# EasyEDA Pro project STM32F767_F429_H743底板原理图_PCB.eprj, board 底板
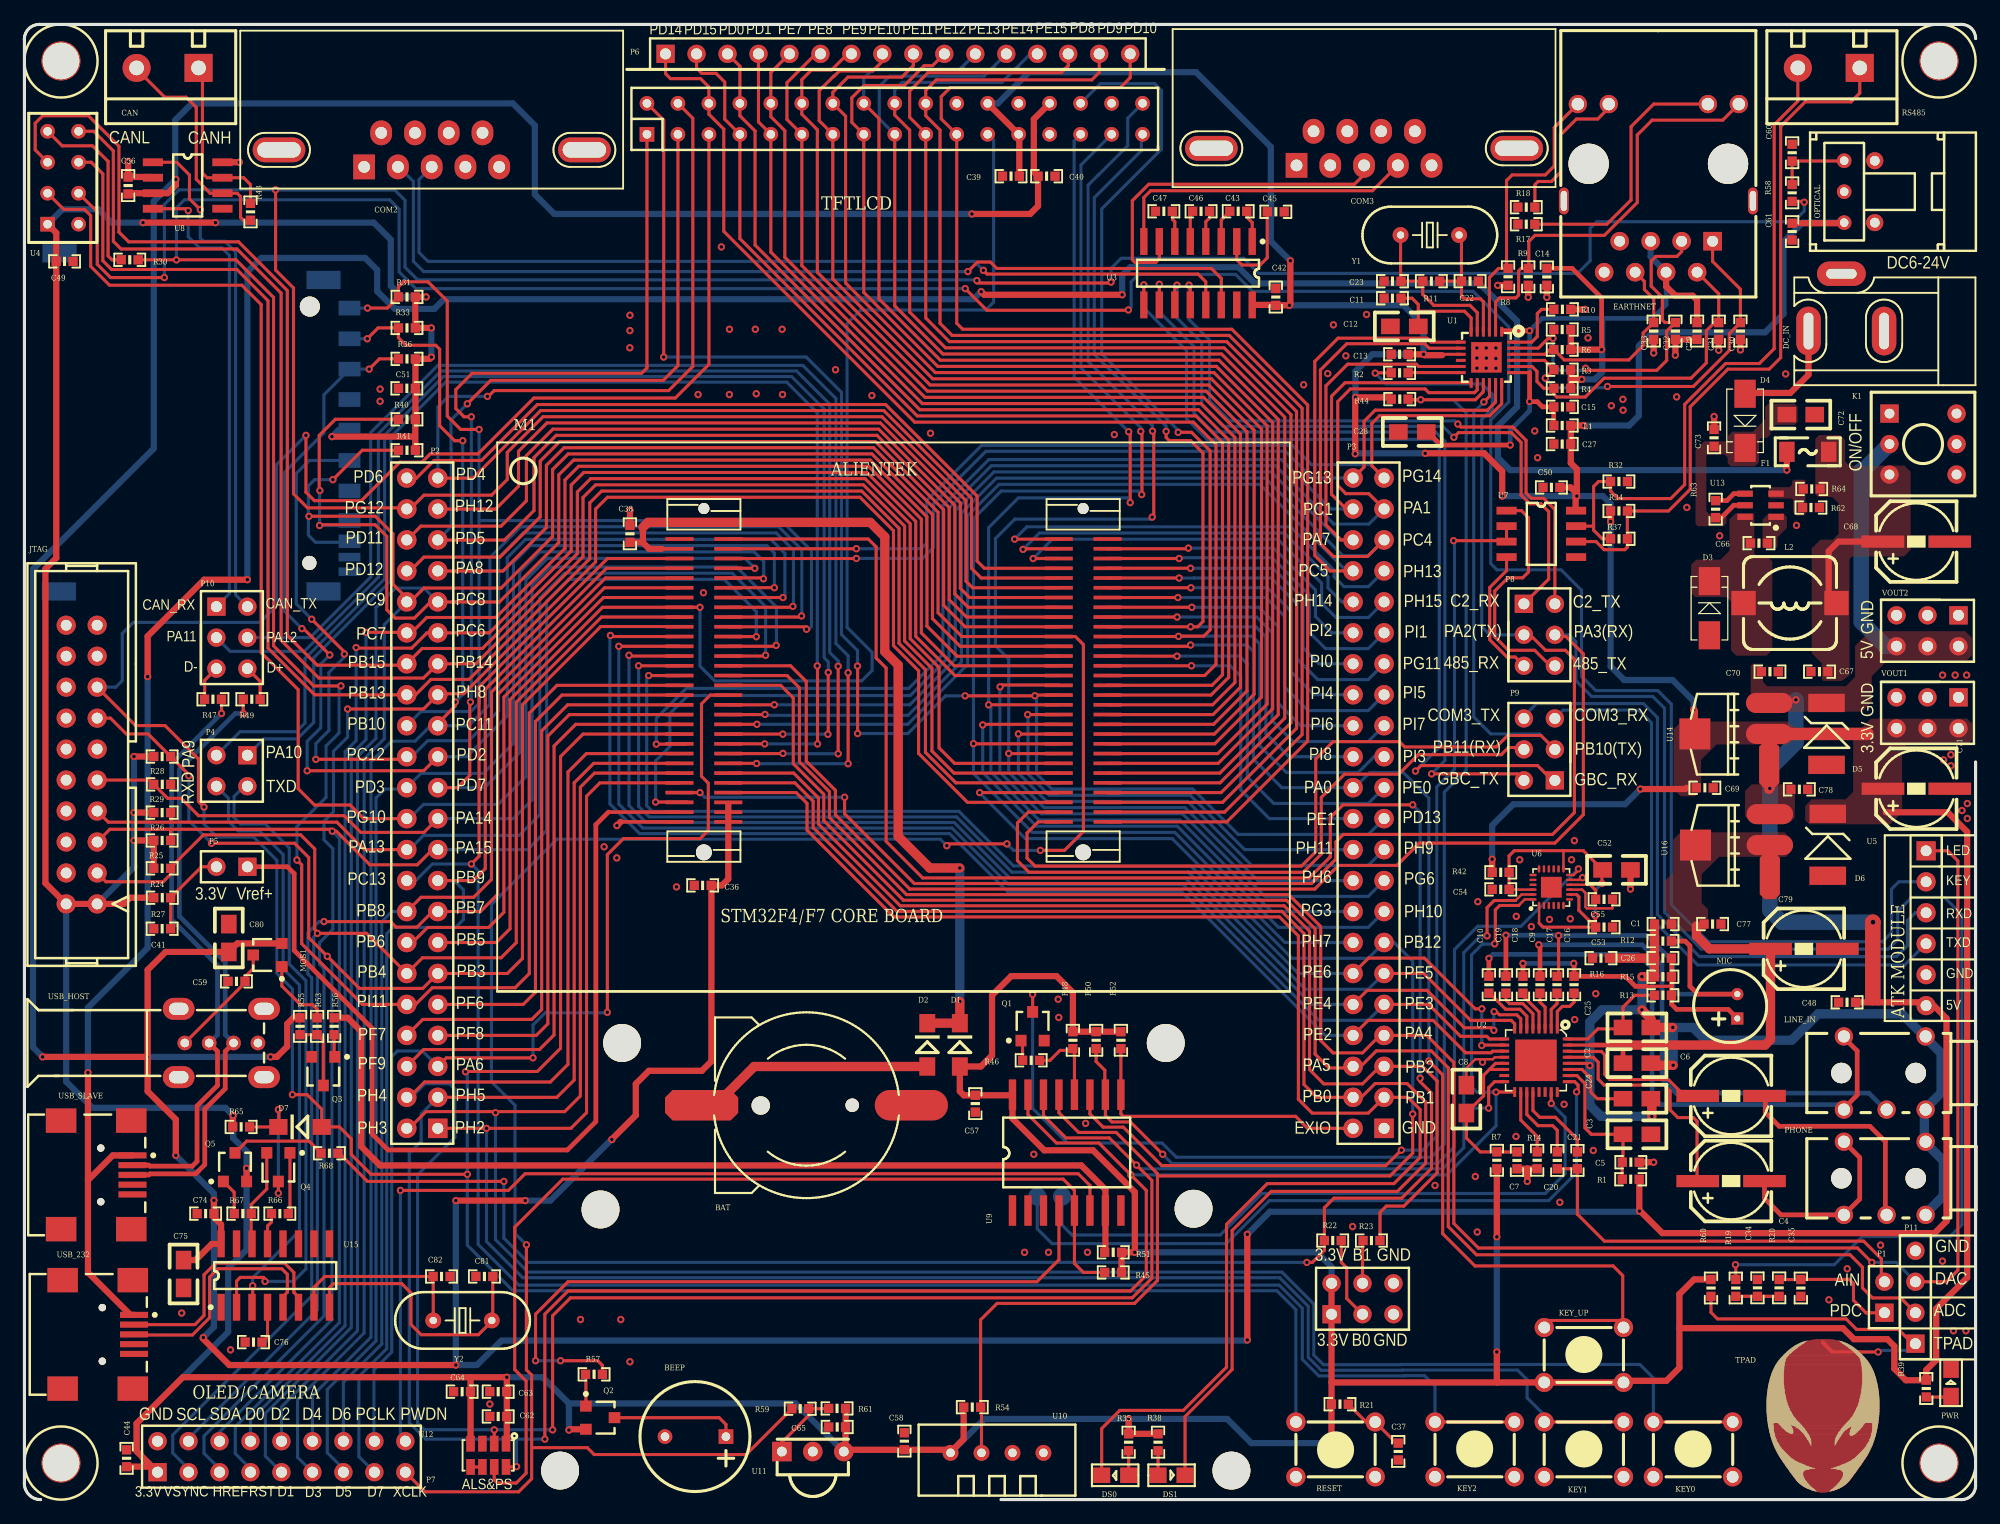
[diagram p4: board, top side]
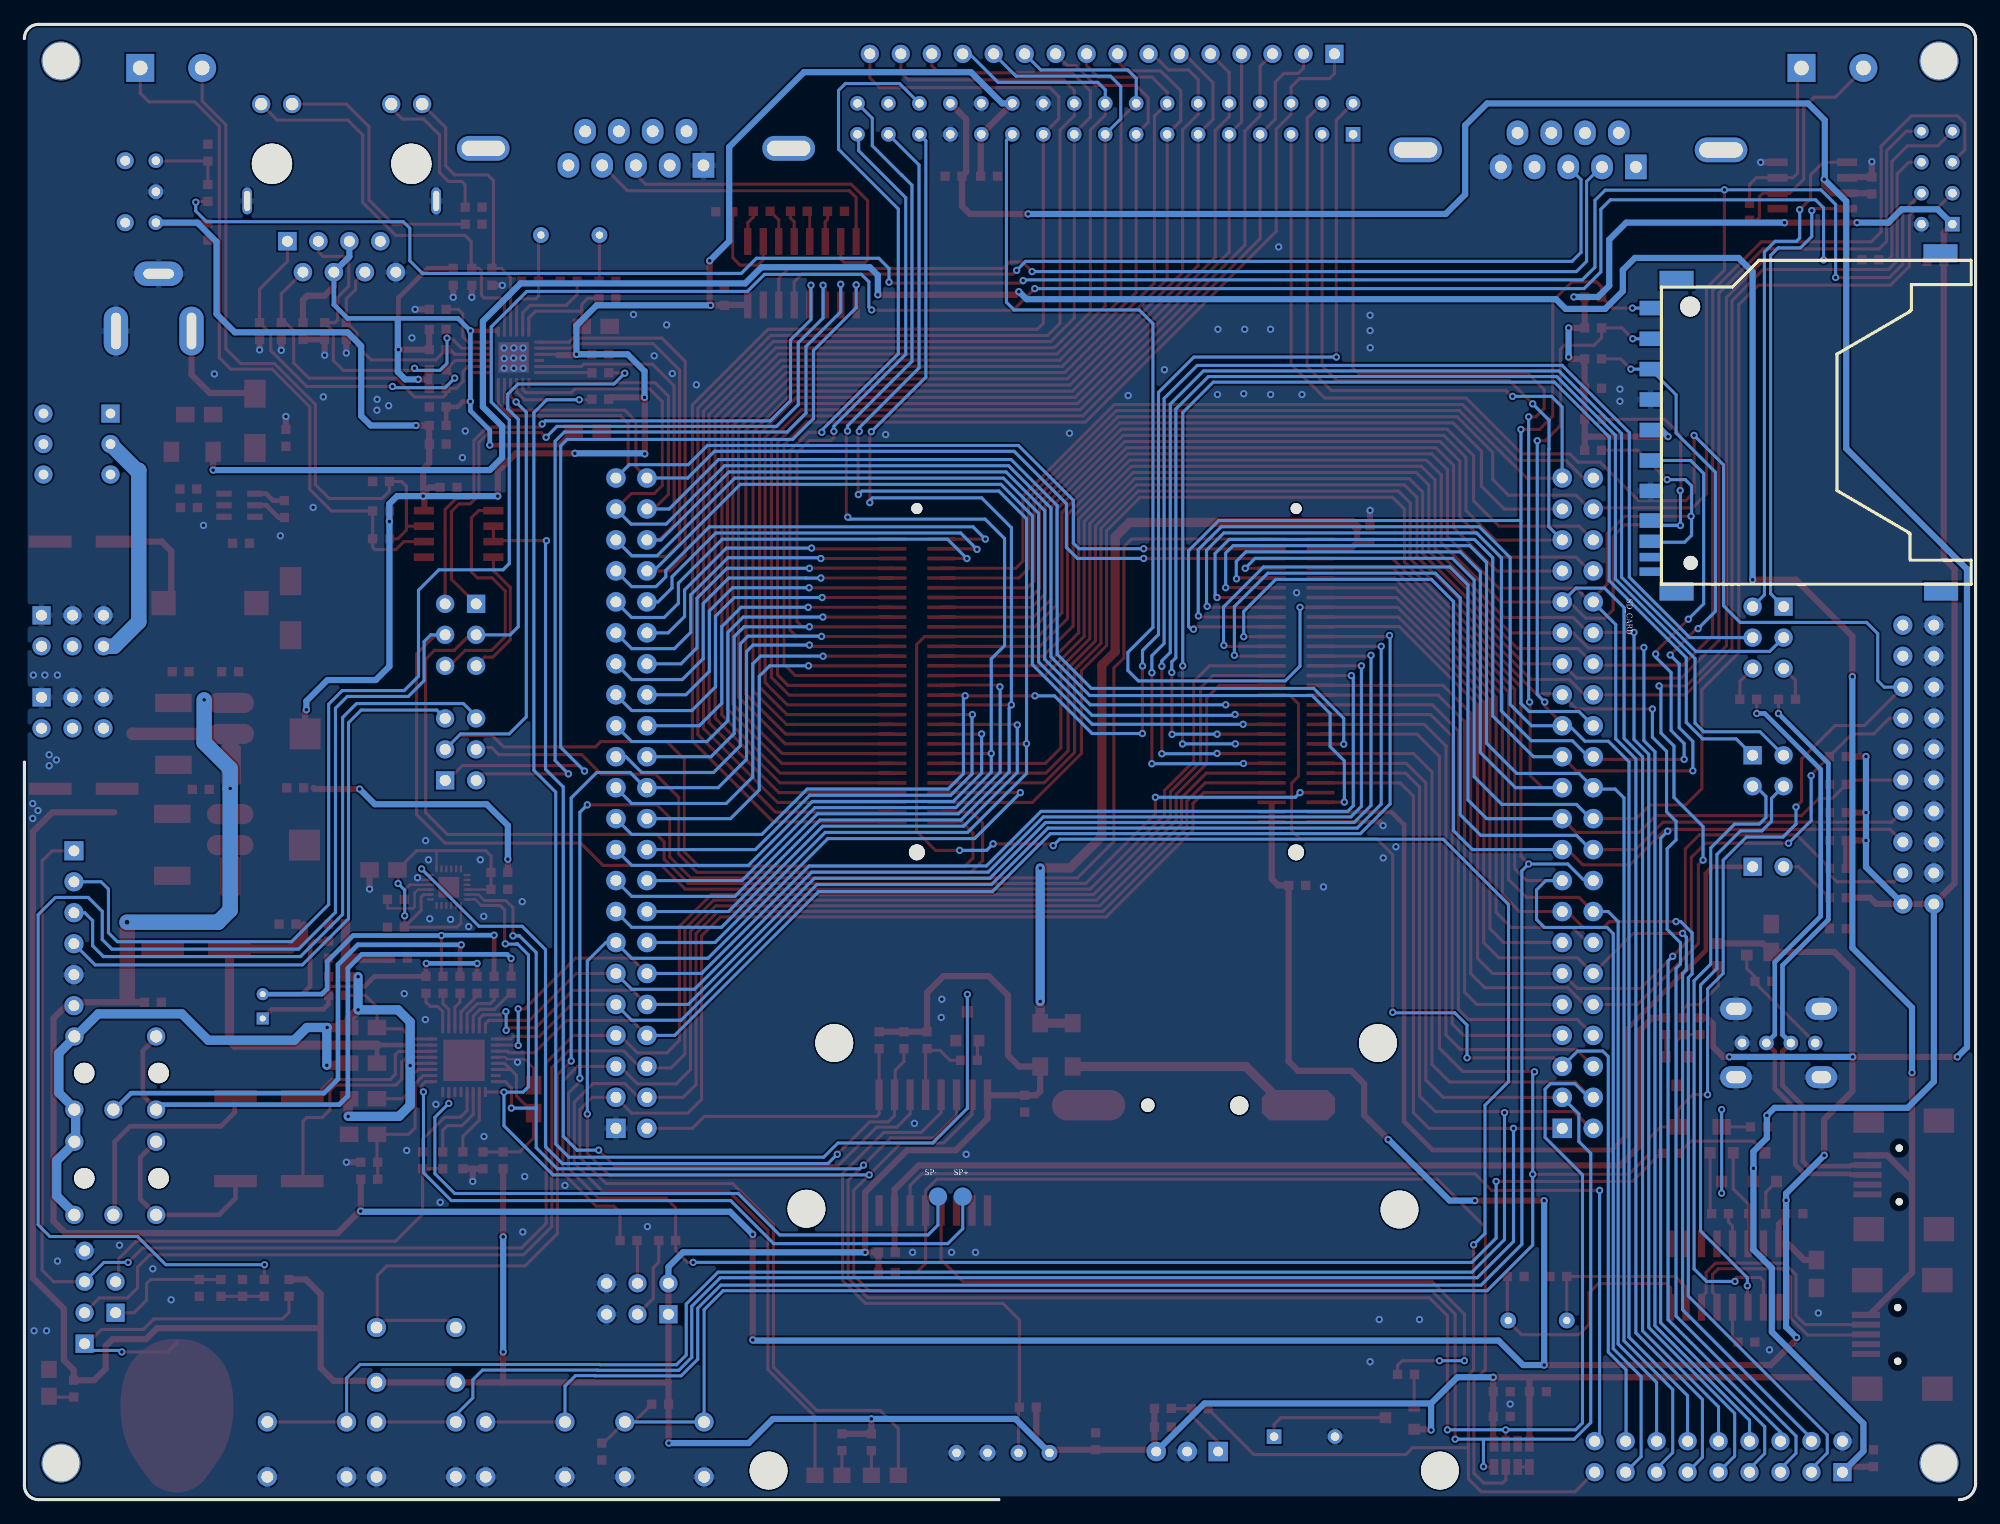
[diagram p5: board, bottom side, seen from below]

Outline 160 x 121 mm; copper layers: Top Layer, Bottom Layer. Coordinates in mm from the lower left corner of the outline.
Outline path: 0,119.79 0,1.32 ; 0,119.79 arc(0.35,120.64) 1.2,120.99 ; 0,119.79 arc(0.35,120.64) 1.2,120.99 ; 0,119.79 0,1.32 ; 0,1.32 arc(0.39,0.39) 1.31,0.01 ; 0,1.32 arc(0.39,0.39) 1.31,0.01 ; 1.2,120.99 1.2,121 ; 1.2,121 158.88,121 ; 1.2,121 158.88,121 ; 158.88,121 158.85,121 ; 1.31,0.01 1.31,0 ; 158.85,0 80.08,0 158.85,0 ; 158.85,0 arc(159.66,0.34) 160,1.15 ; 158.85,0 arc(159.66,0.34) 160,1.15 ; 158.85,121 arc(159.66,120.66) 160,119.85 ; 158.85,121 arc(159.66,120.66) 160,119.85 ; 160,119.85 160,119.85 ; 160,1.15 160,60.5 160,1.15
Stack: Top Layer 0.0356mm / Dielectric1 0.32mm FR-4 er 4.8 / Bottom Layer 0.0356mm

## Design rules (mm)
net PHONE: Inside Board Components
net LINE_IN: Inside Board Components
net USB_SLAVE: Inside Board Components
net U10: Inside Board Components
net SD_CARD: Inside Board Components
net BAT: Inside Board Components
net BEEP: Inside Board Components
net BOOT: Inside Board Components
net C1: Inside Board Components
net C2: Inside Board Components
net C3: Inside Board Components
net C4: Inside Board Components
net C5: Inside Board Components
net C6: Inside Board Components
net C7: Inside Board Components
net C8: Inside Board Components
net C9: Inside Board Components
net C10: Inside Board Components
net C11: Inside Board Components
net C12: Inside Board Components
net C13: Inside Board Components
net C14: Inside Board Components
net C15: Inside Board Components
net C16: Inside Board Components
net C17: Inside Board Components
net C18: Inside Board Components
net C19: Inside Board Components
net C20: Inside Board Components
net C21: Inside Board Components
net C22: Inside Board Components
net C23: Inside Board Components
net C24: Inside Board Components
net C25: Inside Board Components
net C26: Inside Board Components
net C27: Inside Board Components
net C28: Inside Board Components
net C29: Inside Board Components
net C30: Inside Board Components
net C31: Inside Board Components
net C32: Inside Board Components
net C33: Inside Board Components
net C34: Inside Board Components
net C35: Inside Board Components
net C36: Inside Board Components
net C37: Inside Board Components
net C38: Inside Board Components
net C39: Inside Board Components
net C40: Inside Board Components
net C41: Inside Board Components
net C42: Inside Board Components
net C43: Inside Board Components
net C44: Inside Board Components
net C45: Inside Board Components
net C46: Inside Board Components
net C47: Inside Board Components
net C48: Inside Board Components
net C49: Inside Board Components
net C50: Inside Board Components
net C51: Inside Board Components
net C52: Inside Board Components
net C53: Inside Board Components
net C54: Inside Board Components
net C55: Inside Board Components
net C56: Inside Board Components
net C57: Inside Board Components
net C58: Inside Board Components
net C59: Inside Board Components
net C60: Inside Board Components
net C61: Inside Board Components
net C62: Inside Board Components
net C63: Inside Board Components
net C64: Inside Board Components
net C65: Inside Board Components
net C66: Inside Board Components
net C68: Inside Board Components
net C69: Inside Board Components
net C70: Inside Board Components
net C71: Inside Board Components
net C72: Inside Board Components
net C73: Inside Board Components
net C74: Inside Board Components
net C75: Inside Board Components
net C76: Inside Board Components
net C77: Inside Board Components
net C78: Inside Board Components
net C79: Inside Board Components
net C80: Inside Board Components
net C81: Inside Board Components
net C82: Inside Board Components
net CAN: Inside Board Components
net COM2: Inside Board Components
net COM3: Inside Board Components
net D1: Inside Board Components
net D2: Inside Board Components
net D3: Inside Board Components
net D4: Inside Board Components
net D5: Inside Board Components
net D6: Inside Board Components
net D7: Inside Board Components
net DC_IN: Inside Board Components
net DS0: Inside Board Components
net DS1: Inside Board Components
net EARTHNET: Inside Board Components
net F1: Inside Board Components
net JTAG: Inside Board Components
net K1: Inside Board Components
net KEY0: Inside Board Components
net KEY1: Inside Board Components
net KEY2: Inside Board Components
net KEY_UP: Inside Board Components
net L1: Inside Board Components
net L2: Inside Board Components
net M1: Inside Board Components
net MIC: Inside Board Components
net MOS1: Inside Board Components
net P1: Inside Board Components
net P2: Inside Board Components
net P3: Inside Board Components
net P4: Inside Board Components
net P5: Inside Board Components
net P6: Inside Board Components
net P7: Inside Board Components
net P8: Inside Board Components
net P9: Inside Board Components
net P10: Inside Board Components
net P11: Inside Board Components
net PWR: Inside Board Components
net Q1: Inside Board Components
net Q2: Inside Board Components
net Q3: Inside Board Components
net Q4: Inside Board Components
net Q5: Inside Board Components
net R1: Inside Board Components
net R2: Inside Board Components
net R3: Inside Board Components
net R4: Inside Board Components
net R5: Inside Board Components
net R6: Inside Board Components
net R7: Inside Board Components
net R8: Inside Board Components
net R9: Inside Board Components
net R10: Inside Board Components
net R11: Inside Board Components
net R12: Inside Board Components
net R13: Inside Board Components
net R14: Inside Board Components
net R15: Inside Board Components
net R16: Inside Board Components
net R17: Inside Board Components
net R18: Inside Board Components
net R19: Inside Board Components
net R20: Inside Board Components
net R21: Inside Board Components
net R22: Inside Board Components
net R23: Inside Board Components
net R24: Inside Board Components
net R25: Inside Board Components
net R26: Inside Board Components
net R27: Inside Board Components
net R28: Inside Board Components
net R29: Inside Board Components
net R30: Inside Board Components
net R31: Inside Board Components
net R32: Inside Board Components
net R33: Inside Board Components
net R34: Inside Board Components
net R35: Inside Board Components
net R36: Inside Board Components
net R37: Inside Board Components
net R38: Inside Board Components
net R39: Inside Board Components
net R40: Inside Board Components
net R41: Inside Board Components
net R42: Inside Board Components
net R43: Inside Board Components
net R44: Inside Board Components
net R45: Inside Board Components
net R46: Inside Board Components
net R47: Inside Board Components
net R48: Inside Board Components
net R49: Inside Board Components
net R50: Inside Board Components
net R51: Inside Board Components
net R52: Inside Board Components
net R53: Inside Board Components
net R54: Inside Board Components
net R55: Inside Board Components
net R56: Inside Board Components
net R57: Inside Board Components
net R58: Inside Board Components
net R59: Inside Board Components
net R60: Inside Board Components
net R61: Inside Board Components
net R62: Inside Board Components
net R63: Inside Board Components
net R64: Inside Board Components
net R65: Inside Board Components
net R66: Inside Board Components
net R67: Inside Board Components
net R68: Inside Board Components
net RESET: Inside Board Components
net RS485: Inside Board Components
net SP+: Inside Board Components
net SP-: Inside Board Components
net TFTLCD: Inside Board Components
net TPAD: Inside Board Components
net U1: Inside Board Components
net U2: Inside Board Components
net U3: Inside Board Components
net U4: Inside Board Components
net U5: Inside Board Components
net U6: Inside Board Components
net U7: Inside Board Components
net U8: Inside Board Components
net U9: Inside Board Components
net U11: Inside Board Components
net U12: Inside Board Components
net U13: Inside Board Components
net U14: Inside Board Components
net U16: Inside Board Components
net U15: Inside Board Components
net USB_232: Inside Board Components
net USB_HOST: Inside Board Components
net VOUT1: Inside Board Components
net VOUT2: Inside Board Components
net Y1: Inside Board Components
net Y2: Inside Board Components
net C67: Inside Board Components
net OPTICAL: Inside Board Components
net USB_P: USB
net USB_N: USB
via RoutingVias (default): diameter min 0, default 0.7, max 1.27; hole min 0, default 0.5, max 0.711

## Placement (name value [footprint] x y rotation side)
BAT  BATT  [BATM]  64.13 32.35 270 top
BEEP  BEEP  [BELL-5]  57.53 5.17 180 top
BOOT  Header 3X2  [HDR2X3]  107.19 15.2 0 top
C1  104  [C 0603]  134.36 47.21 180 top
C2  10uF  [0805]  131.09 35.8 0 top
C3  10uF  [0805]  133.37 29.96 180 top
C4  220uF  [CM D(6.3*7.7)]  139.95 26.13 180 top
C5  104  [C 0603]  131.72 27.68 180 top
C6  220uF  [CM D(6.3*7.7)]  139.95 33.11 180 top
C7  104  [C 0603]  122.39 27.83 90 top
C8  10uF  [0805]  118.24 34 270 top
C9  1uF  [C 0603]  124.28 42.23 270 top
C10  1uF  [C 0603]  120.09 42.23 270 top
C11  104  [C 0603]  112.19 98.54 0 top
C12  10uF  [0805]  112.01 96.23 0 top
C13  104  [C 0603]  112.77 93.94 0 top
C14  104  [C 0603]  124.84 100.29 90 top
C15  104  [C 0603]  126.11 89.63 180 top
C16  1uF  [C 0603]  127.07 42.23 270 top
C17  1uF  [C 0603]  125.68 42.23 270 top
C18  1uF  [C 0603]  122.88 42.23 270 top
C19  1uF  [C 0603]  121.49 42.23 270 top
C20  104  [C 0603]  125.7 27.83 90 top
C21  104  [C 0603]  127.35 27.83 90 top
C22  22  [C 0603]  118.54 99.94 180 top
C23  22  [C 0603]  112.19 99.94 0 top
C24  10uF  [0805]  133.37 32.88 180 top
C25  10uF  [0805]  133.37 38.72 180 top
C26  221  [C 0603]  134.36 44.41 0 top
C27  104  [C 0603]  126.11 86.58 0 top
C28  10uF  [0805]  112.66 87.57 0 top
C29  223  [C 0603]  137.16 95.85 90 top
C30  10  [C 0603]  140.71 95.85 90 top
C31  10  [C 0603]  138.94 95.85 90 top
C32  10  [C 0603]  135.38 95.85 90 top
C33  10  [C 0603]  133.6 95.85 90 top
C34  102  [C 0603]  142.11 17.36 270 top
C35  101  [C 0603]  145.67 17.36 90 top
C36  104  [C 0603]  55.62 50.38 0 top
C37  104  [C 0603]  112.65 3.94 270 top
C38  104  [C 0603]  49.65 79.21 270 top
C39  104  [C 0603]  80.9 108.55 180 top
C40  104  [C 0603]  83.82 108.55 180 top
C41  104  [C 0603]  11.3 46.83 0 top
C42  104  [C 0603]  102.61 98.64 90 top
C43  104  [C 0603]  99.54 105.67 0 top
C44  104  [C 0603]  8.38 3.39 90 top
C45  104  [C 0603]  102.61 105.63 180 top
C46  104  [C 0603]  96.49 105.67 0 top
C47  104  [C 0603]  93.44 105.67 0 top
C48  104  [C 0603]  149.46 40.79 0 top
C49  104  [C 0603]  3.3 101.56 0 top
C50  104  [C 0603]  125.22 83.02 0 top
C51  104  [C 0603]  31.37 91.15 0 top
C52  10uF  [0805]  129.41 51.65 0 top
C53  104  [C 0603]  129.54 46.95 0 top
C54  104  [C 0603]  121.05 50.05 180 top
C55  104  [C 0603]  129.54 49.24 0 top
C56  104  [C 0603]  8.51 107.79 90 top
C57  104  [C 0603]  77.98 32.48 270 top
C58  104  [C 0603]  72.16 4.79 270 top
C59  104  [C 0603]  17.4 42.51 0 top
C60  22  [C 0603]  144.96 110.48 90 top
C61  104  [C 0603]  144.96 104 270 top
C62  1uF  [C 0603]  38.86 6.82 0 top
C63  104  [C 0603]  38.86 8.85 0 top
C64  104  [C 0603]  35.89 8.85 180 top
C65  104  [C 0603]  66.64 5.96 180 top
C66  103  [C 0603]  142.24 78.45 0 top
C67  104  [C 0603]  147.19 67.91 180 top
C68  220uF  [CM D(6.3*7.7)]  155.14 78.58 180 top
C69  104  [C 0603]  137.79 58.38 180 top
C70  104  [C 0603]  143.13 67.91 180 top
C71  220uF  [CM D(6.3*7.7)]  155.14 58.31 180 top
C72  10uF  [0805]  146.81 88.99 180 top
C73  104  [C 0603]  138.55 87.09 270 top
C74  104  [C 0603]  14.86 23.46 180 top
C75  10uF  [0805]  13.05 19.65 270 top
C76  104  [C 0603]  18.79 12.92 0 top
C77  104  [C 0603]  138.43 47.21 180 top
C78  104  [C 0603]  145.54 58.26 180 top
C79  220uF  [CM D(6.3*7.7)]  145.92 45.18 180 top
C80  10uF  [0805]  16.76 44.92 90 top
C81  22  [C 0603]  37.72 18.3 180 top
C82  22  [C 0603]  34.21 18.3 0 top
CAN  CAN  [KF301-5.0-2P]  9.2 117.43 180 top
COM2  USART_F(母头)  [DB9]  33.4 109.31 0 top
COM3  USART_M(公头)  [DB9]  109.85 109.44 0 top
D1  1N4148  [DIODE_SOP]  76.71 35.52 90 top
D2  1N4148  [DIODE_SOP]  74.04 35.52 90 top
D3  SS14  [DO-214AC]  138.17 73.12 90 top
D4  SS14  [DO-214AC]  141.09 88.48 270 top
D5  SMBJ5.0A  [SMBJ]  147.77 62.68 90 top
D6  SMBJ3.3A  [SMBJ]  147.88 53.58 90 top
D7  1N4148  [DIODE_SOP]  24.38 30.57 180 top
DC_IN  POWER  [DC-005]  152.5 95.85 0 top
DS0  LED1  [SMDLED]  90.55 2 180 top
DS1  LED1  [SMDLED]  92.96 2 0 top
EARTHNET  RJ45  [HR911105A]  133.98 109.56 0 top
F1  1000mA  [FU 1206]  146.24 85.94 0 top
JTAG  JTAG  [JTAG_20]  4.7 60.29 90 top
K1  BUTTON  [KFT DIP-8.5*8.5]  155.69 86.58 0 top
KEY0  -  [KEY_M]  140.08 1.87 180 top
KEY1  -  [KEY_M]  131.12 1.87 180 top
KEY2  -  [KEY_M]  122.17 1.87 180 top
KEY_UP  -  [KEY_M]  131.12 9.62 180 top
L1  220R 2.0A  [L 0603]  126.11 88.1 0 top
L2  4.7uH  [CDRH73]  144.78 73.54 180 top
LINE_IN  LINE_IN  [PJ-313]  152.45 34.99 0 top
M1  -  [STM32F4&F7_CB]  53.72 55.59 0 top
MIC  MIC  [MIC-6022]  139.88 40.47 180 top
MOS1  SI2301  [SOT-23A]  20.06 44.67 90 top
NOREF  -  [Pad_ie14]  157 118 0 top
NOREF#2  -  [Pad_ie15]  3 118 0 top
NOREF#3  -  [Pad_ie16]  157 3 0 top
NOREF#4  -  [Pad_ie17]  3 3 0 top
OPTICAL  DLR1150  [DLR-1150 / 2150]  153.22 107.28 270 top
P1  Header 2  [HDR1X2]  152.52 15.33 90 top
P2  HEAD2*22  [HDR2.54-LI-2x22P]  32.63 54.58 90 top
P3  HEAD2*22  [HDR2.54-LI-2x22P]  110.22 54.58 90 top
P4  USART1  [HDR2X2]  18.29 61.05 180 top
P5  VREF_SEL  [HDR1X2]  18.29 51.91 180 top
P6  HEAD1*16  [HDR1X16]  52.58 118.58 0 top
P7  OV2640  [HDR2X9]  10.92 2.25 0 top
P8  RS232/RS485  [HDR2X3]  122.96 73.47 270 top
P9  RS232/BTCOM&GPS  [HDR2X3]  125.5 58.99 90 top
P10  USB/CAN  [HDR2X3]  15.75 73.24 270 top
P11  Header 4  [HDR1X4]  155.06 12.79 90 top
PHONE  PHONE  [PJ-313]  152.45 26.35 0 top
PWR  SYS  [SMDLED]  157.99 8.47 90 top
Q1  S8050  [SOT-23A]  82.67 38.7 0 top
Q2  S8550  [SOT-23A]  47.09 6.72 270 top
Q3  S8050  [SOT-23A]  24.51 35.27 180 top
Q4  S8050  [SOT-23A]  20.83 27.4 180 top
Q5  S8550  [SOT-23A]  17.27 27.14 0 top
R1  0R  [R 0603]  131.72 26.28 0 top
R2  510R  [R 0603]  112.77 92.42 0 top
R3  49.9R  [R 0603]  126.11 92.67 0 top
R4  49.9R  [R 0603]  126.11 91.15 0 top
R5  49.9R  [R 0603]  126.11 95.98 0 top
R6  49.9R  [R 0603]  126.11 94.32 0 top
R7  10R  [R 0603]  120.74 27.83 270 top
R8  10K  [R 0603]  121.66 100.29 270 top
R9  10K  [R 0603]  123.31 100.29 270 top
R10  12.1K  [R 0603]  126.11 97.63 180 top
R11  1M  [R 0603]  115.36 99.94 180 top
R12  0R  [R 0603]  134.36 45.81 0 top
R13  680R  [R 0603]  134.36 41.37 0 top
R14  10R  [R 0603]  124.04 27.83 270 top
R15  47K  [R 0603]  134.36 42.89 0 top
R16  0R  [R 0603]  129.28 44.41 0 top
R17  510R  [R 0603]  123.16 104.61 0 top
R18  510R  [R 0603]  123.16 106.01 0 top
R19  4.7K  [R 0603]  140.33 17.36 90 top
R20  47K  [R 0603]  143.89 17.36 270 top
R21  10K  [R 0603]  107.87 7.83 180 top
R22  10K  [R 0603]  107.29 21.25 0 top
R23  10K  [R 0603]  110.46 21.25 0 top
R24  10K  [R 0603]  11.3 51.78 0 top
R25  10K  [R 0603]  11.3 54.07 0 top
R26  10K  [R 0603]  11.3 56.35 0 top
R27  10R  [R 0603]  11.3 49.37 180 top
R28  10K  [R 0603]  11.3 60.95 0 top
R29  10K  [R 0603]  11.3 58.66 180 top
R30  1K  [R 0603]  8.63 101.69 180 top
R31  47K  [R 0603]  31.37 98.64 180 top
R32  360R  [R 0603]  130.76 83.5 0 top
R33  47K  [R 0603]  31.37 96.1 180 top
R34  360R  [R 0603]  130.76 81.09 0 top
R35  510R  [R 0603]  90.55 4.7 270 top
R36  47K  [R 0603]  31.37 93.56 180 top
R37  120R  [R 0603]  130.76 78.81 180 top
R38  510R  [R 0603]  92.96 4.7 270 top
R39  510R  [R 0603]  155.95 9.11 270 top
R40  47K  [R 0603]  31.37 88.61 180 top
R41  47K  [R 0603]  31.37 86.07 180 top
R42  10R  [R 0603]  121.05 51.45 180 top
R43  120R  [R 0603]  18.54 105.63 90 top
R44  4.7K  [R 0603]  112.77 90.26 180 top
R45  10K  [R 0603]  89.28 18.63 180 top
R46  4.7K  [R 0603]  82.55 36.03 180 top
R47  10R  [R 0603]  15.47 65.65 0 top
R48  1K  [R 0603]  85.98 37.68 90 top
R49  10R  [R 0603]  18.64 65.65 180 top
R50  10K  [R 0603]  87.88 37.68 90 top
R51  1K  [R 0603]  89.28 20.28 180 top
R52  10K  [R 0603]  89.91 37.68 90 top
R53  10K  [R 0603]  24 38.83 90 top
R54  4.7K  [R 0603]  77.72 7.58 180 top
R55  100K  [R 0603]  22.6 38.83 90 top
R56  4.7K  [R 0603]  25.4 38.83 90 top
R57  1K  [R 0603]  46.71 10.28 180 top
R58  510R  [R 0603]  144.96 107.18 270 top
R59  1K  [R 0603]  63.62 7.46 0 top
R60  100K  [R 0603]  138.3 17.36 90 top
R61  4.7K  [R 0603]  66.64 7.48 0 top
R62  9.53K  [R 0603]  146.5 81.37 0 top
R63  100K  [R 0603]  138.68 81.24 90 top
R64  49.9K  [R 0603]  146.56 82.89 180 top
R65  10K  [R 0603]  17.78 30.57 0 top
R66  1K  [R 0603]  20.95 23.46 0 top
R67  1K  [R 0603]  17.9 23.46 180 top
R68  1K  [R 0603]  25.02 28.41 0 top
RESET  -  [KEY_M]  104.26 6.37 0 top
RS485  RS485  [KF301-5.0-2P]  145.42 117.43 180 top
SD_CARD  sd card  [SDCARD_L]  26.67 95.21 90 bottom
SP+  SPK+  [TP-1.5]  83.06 24.86 270 bottom
SP-  SPK-  [TP-1.5]  85.09 24.86 270 bottom
TFTLCD  TFT_LCD  [DB2*17-4.3]  51.05 111.98 0 top
TPAD  ALIENTEK  [ALIENTEK_PAD1]  147.44 13.17 0 top
U1  LAN8720A  [QFN24]  119.89 93.69 270 top
U2  WM8978  [QFN32_G]  123.95 36.03 270 top
U3  SP3232  [SOP16M]  96.24 100.59 180 top
U4  WIRELESS  [NRF24L01]  4.44 104.61 0 top
U5  ATK MODULE  [HEAD6]  155.93 53.23 270 top
U6  MPU9250  [QFN24-T]  124.2 48.73 90 top
U7  SP3485  [SOP-8]  121.54 81.12 0 top
U8  TJA1050  [SOP-8]  10.54 109.69 0 top
U9  PCF8574T  [SO-16]  81.02 23.71 90 top
U10  DHT11&DS18B20  [DHT11]  79.75 3.34 0 top
U11  HS0038  [VS1838B-A]  64.65 3.94 0 top
U12  -  [AP3216C]  38.04 3.63 180 top
U13  MP2359  [SOT-23-6]  143.63 80.61 180 top
U14  AMS1117-3.3  [SOT223_N_A]  143.08 60.26 90 top
U15  CH340G  [SOP16M]  20.57 18.38 0 top
U16  AMS1117-3.3  [SOT223_N_A]  143.13 51.14 90 top
USB_232  USB  [USB/SM0.8-6H5]  1.14 13.55 180 top
USB_HOST  -  [USB-A-90]  19.65 34.75 0 top
USB_SLAVE  USB-B(Mini)  [USB/SM0.8-6H5]  1.01 26.63 180 top
VOUT1  VCC3.3  [HDR2X3]  158.59 65.8 180 top
VOUT2  VCC5  [HDR2X3]  158.59 72.53 180 top
Y1  25MHz  [OSC HC-49S]  115.25 103.72 180 top
Y2  12MHz  [OSC HC-49S]  35.93 14.7 0 top

## Footprints (pads in the part's own frame, mm; a bottom-side part is the same pattern mirrored in y, then rotated)
0805
  rect 1.524x1.27 smd: 1(0,-0.002) 2(2.286,-0.002)
ALIENTEK_PAD1
  round 0.254 smd: 1(0,-0.254)
AP3216C
  rect 0.7x1.3 smd: 1(-1.455,-0.953) 2(-0.485,-0.953) 3(0.485,-0.953) 4(1.455,-0.953) 5(1.455,0.953) 6(0.485,0.953) 7(-0.485,0.953) 8(-1.455,0.953)
BATM
  round 1.1 hole 1.1: 0(0,3.748)
  round 1.5 hole 1.5: 0(0.025,-3.752)
  custom 2.5x6 smd: 1(0,-8.601)
  oval 2.5x6 smd: 2(0,8.598)
BELL-5
  rect 1.2x1.2 hole 0.7: 1(0,0)
  round 1.2 hole 0.7: 2(5,0)
C 0603
  rect 0.762x0.762 smd: 1(-0.692,0.001) 2(0.692,-0.001)
CDRH73
  rect 2x2 smd: 1(-3.81,0) 2(3.81,0)
CM D(6.3*7.7)
  rect 3.5x1 smd: 1(2.737,0) 2(-2.737,0)
DB2*17-4.3
  round 3.1 hole 3.1: (-7.125,-109.596) (-3.81,-88.18) (-2.037,-74.525) (42.54,-74.525) (44.82,-88.12) (47.925,-109.596)
  rect 1.2x1.2 hole 0.7: 1(-0.002,0.006)
  round 1.2 hole 0.7: 2(-0.002,2.546) 3(2.538,0.006) 4(2.538,2.546) 5(5.08,0) 6(5.078,2.546) 7(7.62,0) 8(7.62,2.54) 9(10.158,0.006) 10(10.158,2.546) 11(12.698,0.006) 12(12.698,2.546) 13(15.238,0.006) 14(15.238,2.546) 15(17.778,0.006) 16(17.778,2.546) 17(20.318,0.006) 18(20.318,2.546) 19(22.858,0.006) 20(22.858,2.546) 21(25.398,0.006) 22(25.398,2.546) 23(27.938,0.006) 24(27.938,2.546) 25(30.478,0.006) 26(30.478,2.546) 27(33.018,0.006) 28(33.018,2.546) 29(35.558,0.006) 30(35.558,2.546) 31(38.098,0.006) 32(38.098,2.546) 33(40.638,0.006) 34(40.638,2.546)
DB9
  oval 4.318x2.032 hole 3.556x1.27: 0(-12.522,1.397) 0(12.522,1.397)
  rect 1.778x2.032 hole 0.965: 1(-5.537,0)
  oval 1.778x2.032 hole 0.965: 2(-2.768,0) 3(0,0) 4(2.768,0) 5(5.537,0) 6(-4.14,2.794) 7(-1.371,2.794) 8(1.397,2.794) 9(4.165,2.794)
DC-005
  oval 2x4 hole 0.8x3: 1(-6.2,0) 2(0,0)
  oval 4x2 hole 2.5x0.8: 3(-3.5,4.7)
DHT11
  round 1.3 hole 0.7: 1(-3.81,0.5) 2(-1.27,0.5) 3(1.27,0.5) 4(3.81,0.5)
DIODE_SOP
  rect 1.5x1.3 smd: 1(0,0) 2(3.556,0)
DLR-1150 / 2150
  round 1.4 hole 0.8: (-2.54,-1.49) (2.54,-1.49)
  round 1.2 hole 0.7: 1(-2.54,-4) 2(0,-4) 3(2.54,-4)
DO-214AC
  rect 2.3x1.75 smd: 1(-2.223,0) 2(2.223,0)
FU 1206
  rect 1.27x1.651 smd: 1(-1.714,0) 2(1.714,0)
HDR1X2
  rect 1.5x1.5 hole 0.9: 1(0,0)
  round 1.5 hole 0.9: 2(2.54,0)
HDR1X4
  rect 1.5x1.5 hole 0.9: 1(0,0)
  round 1.5 hole 0.9: 2(2.54,0) 3(5.08,0) 4(7.62,0)
HDR1X16
  rect 1.5x1.5 hole 0.9: 1(0,0)
  round 1.5 hole 0.9: 2(2.54,0) 3(5.08,0) 4(7.62,0) 5(10.16,0) 6(12.7,0) 7(15.24,0) 8(17.78,0) 9(20.32,0) 10(22.86,0) 11(25.4,0) 12(27.94,0) 13(30.48,0) 14(33.02,0) 15(35.56,0) 16(38.1,0)
HDR2.54-LI-2x22P
  rect 1.6x1.6 hole 0.9: 1(-24.13,-1.27)
  round 1.6 hole 0.9: 2(-24.13,1.27) 3(-21.59,-1.27) 4(-21.59,1.27) 5(-19.05,-1.27) 6(-19.05,1.27) 7(-16.51,-1.27) 8(-16.51,1.27) 9(-13.97,-1.27) 10(-13.97,1.27) 11(-11.43,-1.27) 12(-11.43,1.27) 13(-8.89,-1.27) 14(-8.89,1.27) 15(-6.35,-1.27) 16(-6.35,1.27) 17(-3.81,-1.27) 18(-3.81,1.27) 19(-1.27,-1.27) 20(-1.27,1.27) 21(1.27,-1.27) 22(1.27,1.27) 23(3.81,-1.27) 24(3.81,1.27) 25(6.35,-1.27) 26(6.35,1.27) 27(8.89,-1.27) 28(8.89,1.27) 29(11.43,-1.27) 30(11.43,1.27) 31(13.97,-1.27) 32(13.97,1.27) 33(16.51,-1.27) 34(16.51,1.27) 35(19.05,-1.27) 36(19.05,1.27) 37(21.59,-1.27) 38(21.59,1.27) 39(24.13,-1.27) 40(24.13,1.27) 41(26.67,-1.27) 42(26.67,1.27) 43(29.21,-1.27) 44(29.21,1.27)
HDR2X2
  rect 1.5x1.5 hole 0.9: 1(0,0)
  round 1.5 hole 0.9: 2(0,2.54) 3(2.54,0) 4(2.54,2.54)
HDR2X3
  rect 1.5x1.5 hole 0.9: 1(0,0)
  round 1.5 hole 0.9: 2(0,2.54) 3(2.54,0) 4(2.54,2.54) 5(5.08,0) 6(5.08,2.54)
HDR2X9
  rect 1.5x1.5 hole 0.9: 1(0,0)
  round 1.5 hole 0.9: 2(0,2.54) 3(2.54,0) 4(2.54,2.54) 5(5.08,0) 6(5.08,2.54) 7(7.62,0) 8(7.62,2.54) 9(10.16,0) 10(10.16,2.54) 11(12.7,0) 12(12.7,2.54) 13(15.24,0) 14(15.24,2.54) 15(17.78,0) 16(17.78,2.54) 17(20.32,0) 18(20.32,2.54)
HEAD6
  rect 1.575x1.575 hole 0.889: 1(0.011,0.011)
  round 1.575 hole 0.889: 2(2.551,0.011) 3(5.091,0.011) 4(7.631,0.011) 5(10.171,0.011) 6(12.711,0.011)
HR911105A
  round 3.3 hole 3.3: 0(-5.714,0) 0(5.716,0)
  rect 1.524x1.524 hole 0.889: 1(4.45,-6.35)
  round 1.524 hole 0.889: 2(3.18,-8.89) 3(1.91,-6.35) 4(0.64,-8.89) 5(-0.63,-6.35) 6(-1.9,-8.89) 7(-3.17,-6.35) 8(-4.44,-8.89)
  round 1.5 hole 1.02: 9(6.6,4.9) 10(4.064,4.9) 11(-4.064,4.9) 12(-6.6,4.9)
  oval 0.8x2.2 hole 0.5x1.65: 13(7.75,-3.048) 14(-7.75,-3.048)
JTAG_20
  round 1.575 hole 0.889: 1(-11.43,-1.27) 2(-11.43,1.27) 3(-8.89,-1.27) 4(-8.89,1.27) 5(-6.35,-1.27) 6(-6.35,1.27) 7(-3.81,-1.27) 8(-3.81,1.27) 9(-1.27,-1.27) 10(-1.27,1.27) 11(1.27,-1.27) 12(1.27,1.27) 13(3.81,-1.27) 14(3.81,1.27) 15(6.35,-1.27) 16(6.35,1.27) 17(8.89,-1.27) 18(8.89,1.27) 19(11.43,-1.27) 20(11.43,1.27)
KEY_M
  round 1.575 hole 0.965: 1(0,0) 1(6.5,0) 2(0,-4.5) 2(6.5,-4.5)
KF301-5.0-2P
  rect 2.3x2.3 hole 1.2: 1(-5.08,0)
  round 2.3 hole 1.2: 2(0,0)
KFT DIP-8.5*8.5
  rect 1.5x1.5 hole 0.8: 1(-2.75,2.5)
  round 1.5 hole 0.8: 2(-2.75,0) 3(-2.75,-2.5) 4(2.75,-2.5) 5(2.75,0) 6(2.75,2.5)
L 0603
  rect 0.762x0.762 smd: 1(-0.692,0.001) 2(0.692,-0.001)
MIC-6022
  rect 1x1 hole 0.5: 1(-0.584,1.013)
  round 1 hole 0.5: 2(-0.584,-0.987)
NRF24L01
  round 1.2 hole 0.7: 1(0,0) 3(0,2.54) 4(-2.54,2.54) 5(0,5.08) 6(-2.54,5.08) 7(0,7.62) 8(-2.54,7.62)
  rect 1.2x1.2 hole 0.7: 2(-2.54,0)
OSC HC-49S
  round 1.3 hole 0.6: 1(-2.4,0) 2(2.4,0)
Pad_ie14
  round 3.2 hole 3: (0,0)
Pad_ie15
  round 3.2 hole 3: (0,0)
Pad_ie16
  round 3.2 hole 3: (0,0)
Pad_ie17
  round 3.2 hole 3: (0,0)
PJ-313
  round 1.677 hole 1.677: 0(-3.453,0) 0(2.643,0)
  round 1.5 hole 1: 1(-3.247,3) 1(-3.247,-3) 2(0.253,-3) 3(3.453,3) 3(3.453,-3)
QFN24
  rect 0.8x0.25 smd: 1(-2.101,1.25) 2(-2.101,0.75) 3(-2.101,0.25) 4(-2.101,-0.25) 5(-2.101,-0.75) 6(-2.101,-1.25) 13(2.101,-1.25) 14(2.101,-0.75) 15(2.101,-0.25) 16(2.101,0.25) 17(2.101,0.75) 18(2.101,1.25)
  rect 0.25x0.8 smd: 7(-1.25,-2.101) 8(-0.75,-2.101) 9(-0.25,-2.101) 10(0.25,-2.101) 11(0.75,-2.101) 12(1.25,-2.101) 19(1.25,2.101) 20(0.75,2.101) 21(0.25,2.101) 22(-0.25,2.101) 23(-0.75,2.101) 24(-1.25,2.101)
  rect 2.5x2.5 smd: 25(0,0)
QFN24-T
  oval 0.6x0.2 smd: 1(0,0) 2(0,-0.4) 3(0,-0.8) 4(0,-1.2) 5(0,-1.6) 6(0,-2) 13(3,-2) 14(3,-1.6) 15(3,-1.2) 16(3,-0.8) 17(3,-0.4) 18(3,0)
  oval 0.2x0.6 smd: 7(0.5,-2.5) 8(0.9,-2.5) 9(1.3,-2.5) 10(1.7,-2.5) 11(2.1,-2.5) 12(2.5,-2.5) 19(2.5,0.5) 20(2.1,0.5) 21(1.7,0.5) 22(1.3,0.5) 23(0.9,0.5) 24(0.5,0.5)
  rect 1.7x1.7 smd: 25(1.498,-1.004)
QFN32_G
  rect 0.8x0.25 smd: 1(-2.601,1.75) 2(-2.601,1.25) 3(-2.601,0.75) 4(-2.601,0.25) 5(-2.601,-0.25) 6(-2.601,-0.75) 7(-2.601,-1.25) 8(-2.601,-1.75) 17(2.601,-1.75) 18(2.601,-1.25) 19(2.601,-0.75) 20(2.601,-0.25) 21(2.601,0.25) 22(2.601,0.75) 23(2.601,1.25) 24(2.601,1.75)
  rect 0.25x0.8 smd: 9(-1.75,-2.601) 10(-1.25,-2.601) 11(-0.75,-2.601) 12(-0.25,-2.601) 13(0.25,-2.601) 14(0.75,-2.601) 15(1.25,-2.601) 16(1.75,-2.601) 25(1.75,2.601) 26(1.25,2.601) 27(0.75,2.601) 28(0.25,2.601) 29(-0.25,2.601) 30(-0.75,2.601) 31(-1.25,2.601) 32(-1.75,2.601)
  rect 3.4x3.4 smd: 33(0,0)
R 0603
  rect 0.762x0.762 smd: 1(-0.692,0.001) 2(0.692,-0.001)
SDCARD_L
  rect 1.2x1.8 smd: 1(0,0) 2(-2.489,0) 3(-4.983,-0.009) 4(-7.483,-0.009) 5(-9.983,-0.009) 6(-12.483,-0.009) 7(-14.908,-0.009) 9(2.517,-0.009)
  rect 1.1x1.8 smd: 8(-16.611,0)
  rect 0.7x1.8 smd: 10(-17.908,-0.009) 12(-19.101,0)
  rect 1.5x2.8 smd: 11(-20.727,-23.834) 11(-20.727,-2.143) 11(4.826,-2.143) 11(7.011,-23.784)
  round 1.16 hole 1.16: M1.16(-18.39,-3.3)
  round 1.64 hole 1.64: M1.64(2.642,-3.26)
SMBJ
  rect 1.5x3 smd: 1(-2.413,0) 2(2.667,0)
SMDLED
  rect 1.4x1.27 smd: 1(0,0) 2(2.21,0)
SO-16
  rect 2.5x0.6 smd: 1(0,0) 2(0,-1.27) 3(0,-2.54) 4(0,-3.81) 5(0,-5.08) 6(0,-6.35) 7(0,-7.62) 8(0,-8.89) 9(9.5,-8.89) 10(9.5,-7.62) 11(9.5,-6.35) 12(9.5,-5.08) 13(9.5,-3.81) 14(9.5,-2.54) 15(9.5,-1.27) 16(9.5,0)
SOP16M
  rect 0.6x2.2 smd: 1(-4.445,-2.6) 2(-3.175,-2.6) 3(-1.905,-2.6) 4(-0.635,-2.6) 5(0.635,-2.6) 6(1.905,-2.6) 7(3.175,-2.6) 8(4.445,-2.6) 9(4.445,2.6) 10(3.175,2.6) 11(1.905,2.6) 12(0.635,2.6) 13(-0.635,2.6) 14(-1.905,2.6) 15(-3.175,2.6) 16(-4.445,2.6)
SOP-8
  rect 1.651x0.635 smd: 1(0,0) 2(0,-1.27) 3(0,-2.54) 4(0,-3.81) 5(5.7,-3.81) 6(5.7,-2.54) 7(5.7,-1.27) 8(5.7,0)
SOT223_N_A
  custom 3.81x1.651 smd: 1(0,0)
  oval 1.651x3.81 smd: 2(2.54,0) 3(5.08,0)
  rect 2.54x2.54 smd: 4(2.54,6.096)
SOT-23-6
  rect 1.27x0.508 smd: 1(0,0) 2(0,-0.95) 3(0,-1.9) 4(2.54,-1.9) 5(2.54,-0.95) 6(2.54,0)
SOT-23A
  rect 0.9x0.95 smd: 1(-0.95,-1.048) 2(0.95,-1.048) 3(0,1.302)
STM32F4&F7_CB
  rect 2.3x0.3 smd: J1_1(0,0) J1_2(0,0.8) J1_3(0,1.6) J1_4(0,2.4) J1_5(0,3.2) J1_6(0,4) J1_7(0,4.8) J1_8(0,5.6) J1_9(0,6.4) J1_10(0,7.2) J1_11(0,8) J1_12(0,8.8) J1_13(0,9.6) J1_14(0,10.4) J1_15(0,11.2) J1_16(0,12) J1_17(0,12.8) J1_18(0,13.6) J1_19(0,14.4) J1_20(0,15.2) J1_21(0,16) J1_22(0,16.8) J1_23(0,17.6) J1_24(0,18.4) J1_25(0,19.2) J1_26(0,20) J1_27(0,20.8) J1_28(0,21.6) J1_29(0,22.4) J1_30(0,23.2) J1_31(4,23.2) J1_32(4,22.4) J1_33(4,21.6) J1_34(4,20.8) J1_35(4,20) J1_36(4,19.2) J1_37(4,18.4) J1_38(4,17.6) J1_39(4,16.8) J1_40(4,16) J1_41(4,15.2) J1_42(4,14.4) J1_43(4,13.6) J1_44(4,12.8) J1_45(4,12) J1_46(4,11.2) J1_47(4,10.4) J1_48(4,9.6) J1_49(4,8.8) J1_50(4,8) J1_51(4,7.2) J1_52(4,6.4) J1_53(4,5.6) J1_54(4,4.8) J1_55(4,4) J1_56(4,3.2) J1_57(4,2.4) J1_58(4,1.6) J1_59(4,0.8) J1_60(4,0) J2_1(31.099,0.001) J2_2(31.099,0.801) J2_3(31.099,1.601) J2_4(31.099,2.401) J2_5(31.099,3.201) J2_6(31.099,4.001) J2_7(31.099,4.801) J2_8(31.099,5.601) J2_9(31.099,6.401) J2_10(31.099,7.201) J2_11(31.099,8.001) J2_12(31.099,8.801) J2_13(31.099,9.601) J2_14(31.099,10.401) J2_15(31.099,11.201) J2_16(31.099,12.001) J2_17(31.099,12.801) J2_18(31.099,13.601) J2_19(31.099,14.401) J2_20(31.099,15.201) J2_21(31.099,16.001) J2_22(31.099,16.801) J2_23(31.099,17.601) J2_24(31.099,18.401) J2_25(31.099,19.201) J2_26(31.099,20.001) J2_27(31.099,20.801) J2_28(31.099,21.601) J2_29(31.099,22.401) J2_30(31.099,23.201) J2_31(35.099,23.201) J2_32(35.099,22.401) J2_33(35.099,21.601) J2_34(35.099,20.801) J2_35(35.099,20.001) J2_36(35.099,19.201) J2_37(35.099,18.401) J2_38(35.099,17.601) J2_39(35.099,16.801) J2_40(35.099,16.001) J2_41(35.099,15.201) J2_42(35.099,14.401) J2_43(35.099,13.601) J2_44(35.099,12.801) J2_45(35.099,12.001) J2_46(35.099,11.201) J2_47(35.099,10.401) J2_48(35.099,9.601) J2_49(35.099,8.801) J2_50(35.099,8.001) J2_51(35.099,7.201) J2_52(35.099,6.401) J2_53(35.099,5.601) J2_54(35.099,4.801) J2_55(35.099,4.001) J2_56(35.099,3.201) J2_57(35.099,2.401) J2_58(35.099,1.601) J2_59(35.099,0.801) J2_60(35.099,0.001)
  round 0.9 hole 0.9: M0.9(2,25.7) M0.9(33.099,25.701)
  round 1.3 hole 1.3: M1.3(2,-2.5) M1.3(33.099,-2.499)
TP-1.5
  round 1.5 smd: 1(0,0)
USB-A-90
  round 1.2 hole 0.7: 1(-6.5,2.7) 2(-4.5,2.7) 3(-2.5,2.7) 4(-0.5,2.7)
  oval 2.6x1.8 hole 1.6x1: 5(0,-0.1) 6(0,5.5) 7(-7,5.5) 8(-7,-0.1)
USB/SM0.8-6H5
  rect 2.3x0.5 smd: 1(-7.85,-1.6) 2(-7.85,-0.8) 3(-7.85,0) 4(-7.85,0.8) 5(-7.85,1.6)
  rect 2.5x2 smd: 5(-7.75,4.45) 5(-7.75,-4.45) 5(-1.996,4.45) 5(-1.996,-4.45)
  round 0.6 hole 1.27: MH1(-5.25,2.2) MH2(-5.25,-2.2)
VS1838B-A
  rect 1.6x1.6 hole 0.8: 1(-2.54,0)
  round 1.6 hole 0.8: 2(0,0) 3(2.54,0)

## Nets
As in the schematic.

Pads without a net: BAT 0; COM2 0 1 4 6 7 8 9; COM3 0 2 5 6 7 8 9; EARTHNET 0 7; JTAG 11 17 19; K1 1 4 5 6; LINE_IN 0; M1 M0.9 M1.3; PHONE 0; SD_CARD 10 11 12 M1.16 M1.64; TFTLCD 32; U1 10; U2 15 21 22; U6 2 3 4 5 6 7 14 15 16 17 19 21 25; U8 5; U15 9 10 11 12 15; USB_232 4 MH1 MH2; USB_SLAVE 4 MH1 MH2

## Via types
v1: diameter 0.6, hole 0.3, Top Layer to Bottom Layer, 370 vias
v2: diameter 0.7, hole 0.4, Top Layer to Bottom Layer, 1 via

## Routing (per net, layer and track width the routed paths; a pad name or vN(x,y) marks a point on that pad's centre or on a via; arc(x,y) is an arc through that point)
AGND: length 80.5
  Top Layer w0.254: U2.28 128.19,35.78 v1(128.37,35.6)
  Top Layer w0.762: v1(132.64,42.89) 133.68,42.89 133.66,42.9 133.66,44.41 ; 133.66,47.21 133.66,44.41 ; 129.98,44.41 133.66,44.41 ; 133.66,44.41 133.68,44.41 133.68,44.41 ; C24.1 133.45,32.81 v1(133.45,31.43) ; v1(132.64,40.17) 133.37,39.44 C25.1 v1(135.17,38.73) ; C2.2 133.55,35.63 v1(135.2,35.63)
  Bottom Layer w0.762: 155.8,23.35 157.35,24.91 157.35,27.8 155.8,29.35 155.8,31.99 157.17,33.36 157.17,36.62 153.95,39.84 147.09,39.84 144.93,37.68 137.87,37.68 136.83,38.73 v1(135.17,38.73) 135.2,38.7 v1(135.2,35.63) ; v1(132.64,42.89) v1(132.64,40.17) 129.36,40.17 128.37,39.18 v1(128.37,35.6) 128.37,32.35 129.28,31.43 v1(133.45,31.43)
GND: length 39.1
  Top Layer w0.2: C8.1 118.24,35.39 118.98,36.12 120.41,36.12 120.57,36.28 U2.12 ; U6.9 127.73,50.03 128.01,49.75 128.01,48.61 128.13,48.49 130.22,48.49 130.22,49.22 130.23,49.24 ; v1(127.76,51.01) 127.66,51.01 127.48,50.83 U6.11
  Top Layer w0.254: 124.03,27.14 124.04,27.13
  Top Layer w0.3: 48.89,55.59 M1.J1_1
  Top Layer w0.508: v1(133.6,94.05) 133.6,95.16 ; 49.65,79.9 v1(49.65,81.14) ; v1(140.71,94.3) 140.71,95.16 ; v1(123.24,26.1) 123.24,27.14 ; 123.24,27.14 124.03,27.14 ; 123.24,27.14 122.39,27.14 ; v1(48.59,55.28) 48.89,55.59 ; v1(135.38,93.87) 135.38,95.16 137.16,95.16 ; v1(120.81,99.59) 121.66,99.59 ; 126.79,97.63 v1(127.96,97.63) ; v1(131.7,50.08) C52.2 ; v1(124.84,98.62) 124.84,99.61 ; 10.47,108.48 8.51,108.48 v1(8.51,109.74) ; 132.41,27.68 v1(133.6,27.68) ; v1(138.94,94.27) 138.94,95.16 ; U8.8 v1(17.62,109.69) ; 138.55,87.77 v1(138.55,88.84) ; v1(123.31,98.62) 123.31,99.59
  vias: v1(12.9,15.3) v1(16.9,12.28) v1(29.17,91.08) v1(29.17,90.09) v1(38.17,7.84) v1(45.6,14.77) v1(47.54,53.55) v1(48.58,52.63) v1(48.9,14.77) v1(49.64,94.48) v1(49.66,97.14) v1(49.65,95.89) v1(49.65,11.31) v1(53.47,50.26) v1(55.24,90.64) v1(55.68,74.39) v1(57.15,102.75) v1(57.81,96) v1(57.81,90.64) v1(59.93,96) v1(60.01,90.71) v1(62.13,96) v1(62.16,90.64) v1(66.51,92.68) v1(69.49,90.56) v1(74.3,87.47) v1(82.01,20.28) v1(82.77,28.33) v1(83.97,20.29) v1(84.77,41.04) v1(84.82,39.55) v1(87.02,30.86) v1(87.17,20.29) v1(89.37,87.36) v1(104.9,91.44) v1(106.87,92.36) v1(107.34,96.36) v1(108.36,93.82) v1(108.91,22.4) v1(110.05,97.21) v1(115.67,25.77) v1(118.98,26.5) v1(119.1,94.46) v1(119.1,93.63) v1(119.1,92.8) v1(119.13,21.95) v1(119.18,49.04) v1(119.57,35.88) v1(119.87,94.46) v1(119.88,93.63) v1(119.87,92.8) v1(120.66,94.46) v1(120.66,93.6) v1(120.66,92.8) v1(122.33,47.84) v1(122.31,29.79) v1(122.62,52.48) v1(123.57,47) v1(123.85,87.65) v1(124.08,85.46) v1(125.05,47.59) v1(125.91,24.39) v1(126.25,32.43) v1(126.76,47.64) v1(126.86,52.48) v1(127.1,54.05) v1(127.12,39.37) v1(128.22,95.28) v1(128.65,28.64) v1(128.85,41.5) v1(130.13,89.72) v1(131.08,90.25) v1(131.09,89.36) v1(135.48,90.45) v1(136.32,81.38) v1(139.01,79.05) v1(144.42,92.33) v1(145.31,79.91) v1(147.97,16.39) v1(149.47,18.93) v1(152.2,20.87) v1(157.29,67.63) v1(157.28,19.56) v1(157.38,60.67) v1(157.97,61.09) v1(157.97,60.19) v1(158.18,13.85) v1(158.32,67.63) v1(158.88,56.52) v1(159.21,13.85) v1(159.26,67.63) v1(159.32,57.09) v1(159.32,55.87)
VBAT: length 72.5
  Top Layer w0.254: 52.27,77.99 M1.J1_29
  Top Layer w0.508: 52.27,77.99 51.23,77.99 50.72,78.5 50.72,79.75 ; 49.65,78.51 50.71,78.51
  Top Layer w0.762: v1(76.71,40.86) D1.2 D2.2 ; v1(76.71,51.81) 74.24,51.81 71.65,54.4 71.65,68.45 70.55,69.55 70.55,78.96 69.37,80.15 51.13,80.15 50.72,79.75
  Bottom Layer w0.762: v1(76.71,40.86) v1(76.71,51.81)
VCC3.3: length 775.6
  Top Layer w0.25: 116.33,93.94 U1.9
  Top Layer w0.508: 67.33,4.08 67.33,5.96 67.34,5.97 67.34,7.48 ; 67.33,4.08 67.34,4.09 75.75,4.09 75.94,3.9 77.02,4.98 77.02,7.59 ; 67.33,4.08 U11.3 ; v1(127.88,88.1) 126.81,88.1 126.81,85.02 127.3,84.52 v1(127.3,82.31) ; 138.3,18.06 136.92,18.06 135.71,16.85 135.71,14.06 ; Q2.2 44.72,5.77 v1(44.65,5.7) ; U3.16 102.58,97.99 102.61,97.96 v1(103.73,97.96) 103.81,98.03 v1(103.81,101.61) ; v1(121.18,82.31) 121.18,84.34 119.7,85.82 v1(114.86,85.82) ; 120.75,9.61 131.06,9.61 131.19,9.74 134.64,9.74 135.71,10.81 135.71,14.06 ; 120.75,9.61 120.74,9.62 v1(120.74,12.11) ; 120.75,9.61 107.19,9.61 107.19,9.62 ; v1(90.55,6.62) 90.56,6.62 90.55,6.61 90.55,5.4 R38.1 ; R21.2 107.18,4.66 v1(107.15,4.63) ; U14.4 136.98,64.68 ; 107.19,9.62 BOOT.1 BOOT.2 ; 107.19,9.62 107.19,7.88 ; R24.1 R25.1 v1(8.99,54.07) ; 89.91,38.38 85.98,38.38 85.98,41.59 84.63,42.94 80.92,42.94 79.35,41.37 79.35,36.44 78.43,35.52 D1.1 76.71,33.49 77.04,33.16 80.97,33.16 U9.16 81.02,31.25 83.63,28.65 87.63,28.65 91.06,25.22 v1(91.06,20.28) 89.96,20.28 89.96,18.63 ; 135.71,14.06 149.12,14.06 150.02,13.16 152.76,13.16 153.34,12.59 153.34,10.73 154.28,9.79 155.95,9.79 155.95,10.63 156.77,11.44 156.77,15.66 159.31,18.2 159.31,54.78 157.71,56.38 152.63,56.38 ; U12.1 39.56,4.65 v1(39.56,10.04) 36.58,10.04 ; 112.07,90.26 111.93,90.41 v1(109.15,90.41) 109.15,90.39 109.13,90.36 v1(109.13,85.78) ; 8.38,2.71 10.46,2.71 ; 10.46,2.71 9.2,3.97 9.2,6.25 12.99,10.04 36.58,10.04 ; 10.46,2.71 P7.1 ; v1(25.22,87.19) 32.04,87.19 ; U4.2 2.61,103.9 2.61,77.23 1.72,76.34 1.72,50.56 JTAG.2 JTAG.1 8.15,48.86 8.66,49.37 10.6,49.37 ; 17.09,30.57 17.09,31.49 ; 144.96,104.69 149.17,104.69 OPTICAL.3 ; v1(9.73,104.74) v1(15.67,104.74) ; 125.92,83.02 126.8,83.02 127.2,82.62 127.2,81.15 U7.8 ; v1(8.99,60.95) 8.99,60.95 R28.1 ; 32.05,86.07 32.05,88.61 32.06,88.62 32.06,93.55 32.05,93.56 33.22,93.56 v1(33.37,93.72) ; 136.29,58.38 136.19,58.28 v1(132.51,58.28) ; 120.36,51.45 v1(120.36,52.53) ; 116.25,93.87 114.83,93.87 114.76,93.94 v1(114.73,93.94) 113.47,93.94 ; v1(33.37,96.1) 32.05,96.1 32.05,98.64 v1(32.94,98.64) ; v1(130.07,80.23) 130.07,81.09 ; v1(8.99,56.35) R26.1 ; v1(120.74,21.55) 120.74,27.13 ; 36.58,10.04 U12.4 ; 81.58,108.55 81.58,111.93 TFTLCD.25 TFTLCD.24 ; Q5.2 v1(18.22,27.18)
  Top Layer w1.016: 151.13,62.83 151.1,62.8 U14.2
  Bottom Layer w0.508: OPTICAL.3 145.82,104.74 144.24,103.16 144.24,97.25 142.75,95.75 133.5,95.75 132.38,94.63 132.38,88.89 131.59,88.1 v1(127.88,88.1) ; JTAG.1 8.99,51.88 v1(8.99,54.07) v1(8.99,56.35) v1(8.99,60.95) ; v1(103.73,97.96) 113.08,97.96 114.73,96.3 v1(114.73,93.94) 110.54,93.94 109.15,92.55 v1(109.15,90.41) ; v1(107.15,4.63) 100.61,4.63 98.63,6.62 v1(90.55,6.62) 78.72,6.62 76.01,3.9 75.94,3.9 ; P7.1 9.2,3.97 9.2,6.25 16.71,13.76 16.71,18.99 18.22,20.5 v1(18.22,27.18) 18.22,28.55 17.12,29.66 v1(17.12,31.51) 16.49,32.14 5.57,32.14 3.43,34.28 JTAG.2 ; TFTLCD.24 79.82,114.52 82.38,117.08 96.07,117.08 102.21,110.95 102.21,103.21 v1(103.81,101.61) ; v1(9.73,104.74) 7.16,104.74 6.07,105.83 3.12,105.83 U4.2 ; SD_CARD.4 25.76,87.73 v1(25.22,87.19) ; v1(121.18,82.31) v1(127.3,82.31) 129.44,82.31 130.07,81.68 v1(130.07,80.23) 130.07,68.34 131.19,67.22 135.15,67.22 136.88,65.5 v1(136.88,64.78) ; v1(109.13,85.78) 109.17,85.82 v1(114.86,85.82) ; v1(44.65,5.7) 44.65,7.89 ; 44.65,7.89 63.24,7.89 U11.3 ; 44.65,7.89 42.5,10.04 v1(39.56,10.04) ; BOOT.2 107.19,19.09 105.99,20.28 v1(91.06,20.28) ; v1(33.37,93.72) v1(33.37,96.1) ; v1(120.36,52.53) 120.36,55.3 122.09,57.04 131.26,57.04 v1(132.51,58.28) ; v1(32.94,98.64) 30.96,98.64 30.05,99.56 30.05,103.34 28.65,104.74 v1(15.67,104.74) ; v1(120.74,12.11) v1(120.74,21.55)
VCC3.3A: length 33.1
  Top Layer w0.254: U2.31 128.44,37.28
  Top Layer w0.381: 128.44,37.28 131.09,37.28 C2.1
  Top Layer w0.762: 131.09,37.28 142.74,37.28 143.18,37.73 C79.1 138.17,45.18 137.11,46.24 137.11,47.06
VCC3.3E: length 73.6
  Top Layer w0.25: U1.19 123.43,92.44
  Top Layer w0.381: v1(121.84,86.5) 121.83,86.49 116.15,86.49 115.08,87.57 C28.2 ; v1(123.43,90.07) 123.43,92.44 ; 121.23,95.79 121.31,95.87 v1(123.43,95.87) ; v1(129.33,94.32) 129.33,98.57 126.91,100.99 124.84,100.99 ; 123.43,90.05 124.06,90.05 124.48,89.63 125.41,89.63 125.41,88.11 125.42,88.1
  Top Layer w0.508: 126.81,95.97 126.81,94.32 v1(129.33,94.32) ; 137.16,96.55 137.16,98.39 136.8,98.74 135.38,98.74 134.62,99.5 EARTHNET.4 ; 126.81,91.86 127.68,91.86 ; 126.81,91.86 126.81,92.67 ; 126.81,91.86 126.81,91.15
  Bottom Layer w0.381: 129.34,96.88 133.49,96.88 134.62,98.01 EARTHNET.4 ; 129.34,96.88 129.38,96.84 ; 129.34,96.88 124.44,96.88 v1(123.43,95.87) v1(123.43,90.07) 123.43,89.3 121.84,87.71 v1(121.84,86.5)
  Bottom Layer w0.508: v1(127.71,91.89) 128.78,91.89 129.38,92.5 129.38,96.84 ; EARTHNET.5 133.35,101.94 EARTHNET.4
VCC5: length 548.3
  Top Layer w0.508: C48.2 155.66,40.79 U5.6 156.57,40.52 157.61,39.48 157.61,22.83 156.64,21.86 134.31,21.86 132.47,23.7 ; 10.11,36.36 10.11,43.45 11.58,44.92 16.76,44.92 17.46,45.62 MOS1.2 ; 57.72,57.06 M1.J1_59 M1.J1_60 57.72,50.9 57.2,50.38 56.32,50.38 56.33,50.37 56.33,35.96 55.55,35.17 51.2,35.17 50.14,34.1 50.14,31.52 48.17,29.56 v1(48.17,29.53) ; TFTLCD.28 82.78,113.23 82.78,108.89 83.12,108.55 83.12,106.1 82.47,105.45 v1(77.7,105.45) ; 10.11,36.16 10.11,33.49 12.42,31.18 v1(12.42,28.23) ; 132.42,23.75 132.42,26.28 ; v1(1.5,36.31) 9.95,36.31 ; v1(12.42,108.29) 12.42,107.81 11.76,107.15 U8.3 8.56,107.15 8.51,107.1 ; v1(20.19,36.31) 20.7,36.31 21.55,37.16 21.55,39.02 22.06,39.52 22.61,39.52 ; v1(35.38,24.53) v1(41.07,24.53) ; 13.05,19.65 14.04,19.65 15.36,20.97 16.13,20.97 U15.16 16.13,22.57 15.54,23.15 v1(15.54,24.55) ; 151.57,41.17 151.95,40.79 ; 14.61,13.23 16.81,11.04 v1(35.38,11.04) ; v1(100.28,13.1) v1(100.28,21.76)
  Top Layer w0.762: 143.05,58.26 v1(143.13,58.33)
  Top Layer w1.27: 151.57,41.17 151.57,47.34 v2(151.58,47.36)
  Bottom Layer w0.508: v1(12.42,28.23) 15.54,25.11 v1(15.54,24.55) 15.54,14.16 v1(14.68,13.3) ; 100.23,13.04 39.11,13.04 37.11,11.04 35.44,11.04 ; 35.44,11.04 35.38,11.1 v1(35.38,24.53) ; 35.44,11.04 v1(35.38,11.04) ; v1(10.08,36.31) v1(20.19,36.31) ; v1(48.17,29.53) 48.14,29.53 43.13,24.53 v1(41.07,24.53) ; v1(1.5,36.31) 0.71,37.1 0.71,76.32 10.61,86.22 10.61,106.48 v1(12.42,108.29) ; v1(100.28,21.76) 102.13,23.61 132.38,23.61 ; v1(77.7,105.45) 43.46,105.45 41.86,107.05 41.86,112.71 40.05,114.52 13.74,114.52 12.37,113.15 12.37,108.29
  Bottom Layer w1.27: v1(145.26,65.6) 145.26,62.09 143.13,59.96 v1(143.13,58.33) 143.13,48.35 144.12,47.36 v2(151.58,47.36) ; VOUT2.6 152.63,69.99 150.62,72 150.62,84.42 150.78,84.42 K1.2
  vias: v1(132.43,23.66)
1WIRE_DQ: length 133.4
  Top Layer w0.254: 92.91,26.55 111.98,26.55 113.84,28.41 v1(113.84,31.63) ; 92.91,26.55 92.91,17.97 91.03,16.09 79.75,16.09 78.41,14.75 78.41,7.58 78.48,7.51 U10.2 ; 92.91,26.55 92.91,26.73 89.53,30.12 86.45,30.12 84.83,31.73 U9.13 ; v1(78.33,57.99) M1.J2_4
  Bottom Layer w0.254: v1(78.33,57.99) 78.33,57.97 82.08,54.22 94.12,54.22 103.94,44.4 110.2,44.4 P3.13 112.32,45.69 113.84,44.17 v1(113.84,31.63)
9D_INT: length 66.7
  Top Layer w0.2: v1(127.43,51.73) 127.43,51.63 127.03,51.23 U6.12
  Top Layer w0.254: 87.88,37 87.88,35.93 88.59,35.22 88.59,33.26 U9.10 88.64,31.51 89.18,30.98 90.69,30.98 v1(93.34,28.33)
  Bottom Layer w0.254: v1(93.34,28.33) 94.1,27.56 115.89,27.56 117.27,28.94 117.27,45.12 119.18,47.03 122.72,47.03 v1(127.43,51.73)
AP_INT: length 81.4
  Top Layer w0.254: 88.58,18.63 86.84,18.63 86.1,19.37 U9.5 86.1,25.36 85.18,26.28 44.15,26.28 40.21,22.34 40.21,10.66 41.14,9.73 41.14,2.17 40.33,1.36 38.78,1.36 38.52,1.62 U12.7
BEEP: length 59
  Top Layer w0.254: 47.39,10.28 47.39,11.01 47.01,11.39 v1(43.97,11.39) ; v1(41.92,11.39) 41.92,15.21 44.57,17.87 83.03,17.87 84.83,19.67 U9.4
  Bottom Layer w0.254: v1(41.92,11.39) v1(43.97,11.39)
BOOT0: length 217.5
  Top Layer w0.254: v1(113.84,56.99) 108.12,56.99 107.08,55.95 107.08,52.72 105.36,50.99 73.66,50.99 70.66,53.99 70.66,68.21 69.84,69.03 69.84,78.15 69.2,78.79 M1.J1_31 ; v1(105.16,19.46) 105.61,19.46 106.6,20.45 106.6,23.94 107.39,24.73 112.94,24.73 115.38,27.17 115.38,33.34 114.45,34.28 v1(114.45,34.56) ; 25.72,28.41 25.79,28.34 25.9,28.34 28.13,26.1 v1(39.32,26.1)
  Bottom Layer w0.254: v1(114.45,34.56) 114.45,56.38 v1(113.84,56.99) ; v1(105.16,19.46) 41.3,19.46 39.32,21.44 v1(39.32,26.1)
BOOT1: length 93.6
  Top Layer w0.254: 111.16,21.25 111.16,23.56 111.68,24.07 113.12,24.07 115.84,26.8 115.84,34.33 114.64,35.53 P3.5 111.16,35.53 109.73,34.1 106.55,34.1 105.38,35.27 105.38,46.62 103.3,48.71 71.82,48.71 65.11,55.41 65.11,57.56 63.08,59.59 M1.J1_55
CAN_RX: length 38.4
  Top Layer w0.254: U8.4 13.28,105.88 v1(13.43,105.73)
  Bottom Layer w0.254: v1(13.43,105.73) 13.43,103.6 14.36,102.67 16.19,102.67 16.81,102.05 16.81,74.31 P10.1
CAN_TX: length 41.8
  Top Layer w0.254: U8.1 12.49,109.69 13.54,108.65 13.54,106.69 v1(14.42,105.81)
  Bottom Layer w0.254: P10.2 17.32,74.21 17.32,102.33 16.44,103.21 14.69,103.21 14.42,103.47 v1(14.42,105.81)
CH340_D+: length 19.8
  Top Layer w0.254: USB_232.3 9.04,13.5 13.78,13.5 15.19,14.91 15.19,18.25 15.87,18.94 21.11,18.94 21.56,18.48 21.56,17.01 21.21,16.65 21.21,15.78
CH340_D-: length 20.5
  Top Layer w0.254: 22.48,15.78 22.48,16.61 22.1,16.99 22.1,18.63 21.33,19.39 15.68,19.39 14.73,18.44 14.73,15.1 13.98,14.35 USB_232.2
DCMI_D0: length 147.9
  Top Layer w0.254: 27.2,69.84 31.75,69.84 33.01,71.09 38.12,71.09 44.84,77.81 44.84,83.22 45.86,84.25 69.08,84.25 73.09,80.23 73.09,70.8 76.31,67.59 M1.J2_16 ; 27.2,69.86 v1(27.2,69.89)
  Bottom Layer w0.254: P7.8 18.54,6.51 26.29,14.26 26.29,61.34 27.2,62.25 v1(27.2,69.89)
DCMI_D1: length 151
  Top Layer w0.254: v1(28.01,71.13) 31.32,71.13 31.47,70.98 31.62,70.98 32.99,72.35 38.66,72.35 44.33,78.02 44.33,83.63 45.45,84.75 69.22,84.75 73.55,80.42 73.55,71.09 76.25,68.39 M1.J2_17
  Bottom Layer w0.254: P7.9 19.76,3.57 19.76,7.08 26.8,14.12 26.8,61.13 28.01,62.34 v1(28.01,71.13)
DCMI_D2: length 182.6
  Top Layer w0.254: 30.67,88.61 25.5,88.61 24.18,87.29 24.18,82.82 ; 24.26,79.96 28.76,79.96 29.72,79 29.72,72.99 30.4,72.3 31.98,72.3 33.3,73.62 38.94,73.62 43.82,78.5 43.82,84.05 45.03,85.26 69.35,85.26 74.01,80.61 74.01,71.65 76.48,69.18 84.81,69.18 M1.J2_18
  Bottom Layer w0.254: SD_CARD.7 26.52,80.31 26.11,79.9 v1(24.2,79.9) 24.2,82.74 v1(24.23,82.77) ; 33.91,73.62 32.76,74.77 30.43,74.77 28.83,73.17 28.83,62.44 27.31,60.92 27.31,13.84 21.08,7.61 P7.10
DCMI_D3: length 178.7
  Top Layer w0.254: v1(25.3,83.66) 27.71,86.07 30.67,86.07 ; M1.J2_19 76.73,69.99 74.46,72.26 74.46,80.8 69.49,85.77 44.59,85.77 43.31,84.49 43.31,78.99 39.09,74.77 32.76,74.77 31.62,73.62 31.37,73.62 31.37,73.94 30.22,75.08 30.22,79.21 28.78,80.65 v1(23.33,80.65)
  Bottom Layer w0.254: 31.37,73.62 29.51,71.77 29.51,62.41 27.86,60.76 27.86,13.67 22.4,8.21 22.4,3.47 P7.11 ; SD_CARD.8 26.59,78.53 23.86,78.53 23.29,79.1 23.29,83.15 23.8,83.66 v1(25.3,83.66)
DCMI_D4: length 162.2
  Top Layer w0.254: P2.27 33.9,63.66 35.33,65.09 v1(35.33,65.42) ; M1.J1_39 63.63,72.39 v1(63.73,72.48) ; v1(35.95,86.85) 35.28,86.85 34.05,88.08 34.05,94.36 33.73,94.68 31.29,94.68 30.67,95.3 30.67,96.1 29.01,96.1 v1(28.11,95.21)
  Bottom Layer w0.254: v1(35.95,86.85) 35.95,66.04 v1(35.33,65.42) ; v1(63.73,72.48) 63.74,72.48 63.75,72.48 63.75,77.9 61.85,79.8 40.7,79.8 38.17,77.26 38.17,65.22 36.42,63.47 33.31,63.47 32.04,62.21 30.11,62.21 28.42,60.52 28.42,13.33 23.62,8.52 P7.12 ; SD_CARD.1 v1(28.11,95.21)
DCMI_D5: length 114.3
  Top Layer w0.254: v1(61.5,74.8) 57.73,74.8 M1.J1_36
  Bottom Layer w0.254: v1(61.5,74.8) 61.5,77.63 60.88,78.25 41.48,78.25 40.1,76.88 40.1,62.04 37.63,59.56 32.52,59.56 31.24,58.28 29.56,58.28 28.83,57.55 28.83,13.03 24.84,9.03 24.84,3.85 26.16,2.53 P7.13
DCMI_D6: length 89
  Top Layer w0.254: M1.J1_26 47.65,75.59 38.3,66.24 38.3,50.87 36.84,49.4 32.52,49.4 P2.16
  Bottom Layer w0.254: P7.14 26.16,9.62 29.31,12.77 29.31,47.41 30.13,48.23 P2.16
DCMI_D7: length 96.3
  Top Layer w0.254: M1.J1_27 47.73,76.39 37.79,66.45 37.79,51.75 36.81,50.77 P2.17
  Bottom Layer w0.254: P7.15 27.43,3.52 27.43,10.1 29.72,12.38 29.72,46.42 30.22,46.93 35.35,46.93 36,47.58 36,50.01 35.24,50.77 P2.17
DCMI_HREF: length 156.8
  Top Layer w0.254: v1(26.5,64.85) 32.73,64.85 33.98,66.1 36.03,66.1 46.84,76.91 46.84,81.25 47.81,82.21 68.52,82.21 71.26,79.47 71.26,70.05 73.33,67.98 73.33,61.2 77.34,57.19 M1.J2_3
  Bottom Layer w0.254: P7.5 16,2.53 14.73,3.8 14.73,5.22 24.56,15.05 24.56,43.57 24.2,43.93 24.2,45.68 25.3,46.78 25.3,53.39 24.56,54.12 24.56,55.64 25.34,56.42 25.34,61.38 26.5,62.54 v1(26.5,64.85)
DCMI_PCLK: length 89.1
  Top Layer w0.254: M1.J1_47 56.24,65.99 55.52,65.27 55.52,59.32 56.08,58.76 56.08,54.88 55.41,54.22 49.12,54.22 47.8,52.9 v1(47.8,39.97) ; P2.5 34.59,36.23 41.7,36.23 v1(41.7,36.24)
  Bottom Layer w0.254: P2.5 32.64,36.79 30.58,36.79 30.12,36.34 30.12,12.1 28.66,10.65 28.66,4.83 P7.16 ; v1(47.8,39.97) 47.76,39.93 42.71,39.93 41.7,38.93 v1(41.7,36.24)
DCMI_PWDN: length 80.3
  Top Layer w0.254: v1(30.83,25.36) 39.69,25.36 41.05,26.73 86.42,26.73 87.37,25.77 U9.6
  Bottom Layer w0.254: v1(30.83,25.36) 30.83,5.2 P7.18
DCMI_RESET: length 139.6
  Top Layer w0.254: 11.99,53.81 R25.2 11.99,54.98 ; v1(60.02,70.78) 60.01,70.78 57.72,70.78 M1.J1_41 ; 11.99,54.98 25.09,54.98 v1(25.25,54.83) 25.58,54.83 28.34,52.07 32.22,52.07 33.46,53.31 P2.19 ; 11.99,54.98 7.01,54.98 JTAG.5
  Bottom Layer w0.254: v1(60.02,70.78) 60.02,72.85 57.39,75.48 44.62,75.48 42.82,73.67 42.82,54.88 41.26,53.31 P2.19 ; 25.42,54.65 25.83,54.24 25.83,14.51 17.3,5.98 17.3,3.77 18.54,2.53 P7.7
DCMI_SCL: length 128.6
  Top Layer w0.254: JTAG.3 6.69,50.68 11.38,50.68 11.99,51.29 11.99,51.84 14.68,54.52 22.65,54.52 23.81,53.37 23.81,46.77 24.13,46.44 ; v1(24.03,46.44) 24.13,46.44 ; 24.13,46.44 28.06,46.44 P2.12 32.64,44.44 39.09,44.44 40.33,45.68 40.33,65.4 47.32,72.39 M1.J1_22
  Bottom Layer w0.254: P7.4 13.46,5.01 24.03,15.58 24.03,43.14 23.72,43.45 23.72,46.14 v1(24.03,46.44)
DCMI_SDA: length 131.2
  Top Layer w0.254: M1.J1_21 53.7,71.61 47.26,71.61 40.84,65.19 40.84,44.39 39.61,43.15 P2.11 32.67,41.93 27.48,41.93 v1(24.84,44.57) 23.31,46.09 23.31,52.67 22.15,53.84 v1(15.34,53.84) ; JTAG.13 7.06,64.1 8.35,62.8 10.14,62.8 R28.2 13.48,59.46 v1(13.48,59.37)
  Bottom Layer w0.254: v1(24.84,44.57) 25.22,44.19 25.22,14.76 16,5.54 P7.6 ; v1(15.34,53.84) 13.48,55.69 v1(13.48,59.37)
DCMI_VSYNC: length 101.8
  Top Layer w0.254: v1(24.56,47.41) 30.02,47.41 30.48,46.95 32.19,46.95 33.47,48.23 P2.15 37.4,48.23 38.81,49.65 38.81,66.03 47.57,74.79 M1.J1_25
  Bottom Layer w0.254: P7.3 13.46,2.53 12.16,3.82 12.16,5.31 23.56,16.7 23.56,42.8 23.25,43.12 23.25,46.48 24.17,47.41 v1(24.56,47.41)
DCMI_XCLK: length 222.2
  Top Layer w0.254: v1(41.16,20.9) 41.16,10.65 41.6,10.21 41.6,4.23 ; 41.6,4.23 41.63,4.26 46.16,4.26 46.72,3.7 59.18,3.7 62.94,7.46 ; 41.6,4.23 41.6,1.71 40.53,0.64 32.85,0.64 P7.17 ; v1(80.57,53.79) 75.74,53.79 75.64,53.68 v1(75.64,53.63) ; v1(83.31,53.25) 85.29,53.25 86.84,54.8 86.84,70.13 86.18,70.79 M1.J2_20 76.87,70.79 74.92,72.74 74.92,80.99 69.63,86.28 44.25,86.28 42.8,84.83 42.8,79.73 39.24,76.16 33.91,76.16
  Bottom Layer w0.254: v1(75.64,53.63) 75.11,54.17 43.66,54.17 38.3,48.81 38.3,34.28 40.23,32.35 40.23,21.83 41.15,20.92 ; v1(83.31,53.25) 81.1,53.25 v1(80.57,53.79) ; P7.17 31.24,2.53
ETH_MDC: length 102.1
  Top Layer w0.254: P3.42 108.38,81.25 107.19,82.45 107.19,90.5 108.29,91.61 118.62,91.61 U1.13 ; M1.J1_9 54.24,61.99 54.24,61.97 v1(51.81,61.97) ; 108.95,81.12 108.96,81.12
  Bottom Layer w0.254: v1(51.81,61.97) 51.81,64.08 54.27,66.54 72.51,66.54 75.31,69.34 75.31,81.54 79.08,85.31 103.07,85.31 107.12,81.25 P3.42
ETH_MDIO: length 132.8
  Top Layer w0.254: 112.09,92.42 110.79,92.42 v1(110.77,92.39) ; M1.J1_4 v1(55.39,57.99) ; v1(67.26,57.61) 67.26,56.25 72.97,50.53 105.55,50.53 107.54,52.53 107.54,53.95 108.15,54.56 125.31,54.56 127.1,56.35 127.1,68.92 126.36,69.66 124.74,69.66 123.71,70.69 123.2,70.69 P8.3
  Bottom Layer w0.254: v1(110.77,92.39) 111.66,91.51 119.53,91.51 120.36,90.67 120.36,89.47 119.5,88.61 119.5,71.59 120.16,70.93 P8.3 ; 55.41,57.98 55.78,57.61 v1(67.26,57.61)
ETH_RESET: length 118.7
  Top Layer w0.25: 119.64,90.95 U1.15
  Top Layer w0.254: 119.64,90.95 119.63,90.94 119.63,90.87 118.97,90.21 113.51,90.21 113.46,90.26 ; Q1.3 v1(82.67,41.44)
  Bottom Layer w0.254: v1(114.5,90.21) 117.16,90.21 118.22,89.15 118.22,59.82 116.43,58.03 116.43,29.17 115.35,28.09 94.46,28.09 93.29,29.25 85.52,29.25 82.67,32.09 v1(82.67,41.44)
EXIO: length 24.9
  Top Layer w0.254: 89.91,37 U9.9 89.91,31.64 90.12,31.43 104.25,31.43 105.23,30.45 P3.2
FMC_A16_CLE: length 69.7
  Top Layer w0.254: 31.37,78.7 32.51,79.85 39.09,79.85 41.16,81.92 41.16,85.63 43.33,87.8 70.05,87.8 76.29,81.56 76.29,74.29 77.39,73.19 M1.J2_23
FMC_A17_ALE: length 71.4
  Top Layer w0.254: M1.J2_21 77.14,71.59 75.38,73.35 75.38,81.18 69.77,86.79 43.9,86.79 42.3,85.18 42.3,80.6 39,77.31 32.76,77.31 31.62,76.16 31.37,76.16
FMC_A18: length 121
  Top Layer w0.254: v1(52.42,93.72) 52.42,113.15 TFTLCD.2 ; v1(77.14,65.93) 82.85,65.93 v1(82.86,65.93) 82.92,65.99 M1.J2_14 ; v1(68.32,62.83) 68.32,68.36 v1(68.31,68.37)
  Bottom Layer w0.254: v1(68.31,68.37) 68.31,69.65 67,70.96 67,90.82 64.11,93.72 v1(52.42,93.72) ; v1(77.14,65.93) 75.54,65.93 72.44,62.83 v1(68.32,62.83) ; v1(82.86,65.93) 83,65.79 83,59.53 84.25,58.28 95.81,58.28 99.53,54.56 110.2,54.56 P3.21
FMC_D0: length 92.9
  Top Layer w0.254: P6.1 52.58,116.96 52.98,116.55 55.45,116.55 56.13,115.87 TFTLCD.6 56.13,114.52 56.13,113.63 57.35,112.41 57.35,104.03 73,88.38 95.86,88.38 97.71,86.52 97.71,68.52 96.78,67.59 M1.J2_45
FMC_D1: length 92.6
  Top Layer w0.254: P6.2 55.12,117.41 55.55,116.98 56.72,116.98 57.43,116.27 57.43,113.22 TFTLCD.7 58.67,103.42 73.21,88.88 96.07,88.88 98.24,86.71 98.24,67.65 97.38,66.79 M1.J2_46
